# Altium schematic sheet MGMEZZ04TEST.SchDoc
size Letter; Author: Adam Gilbert; CompanyName: McGill University; DrawnBy: Adam Gilbert; Organization: Altium Limited; Address1: McGill Cosmology; Address2: 3600 University Street; Address3: Montreal, Quebec; Address4: Canada; Revision: Rev0; ProjectTitle: Dan DfMux Mezz; ModelNumber: MGMEZZ04; ProjectName: Dan DfMux Mezz
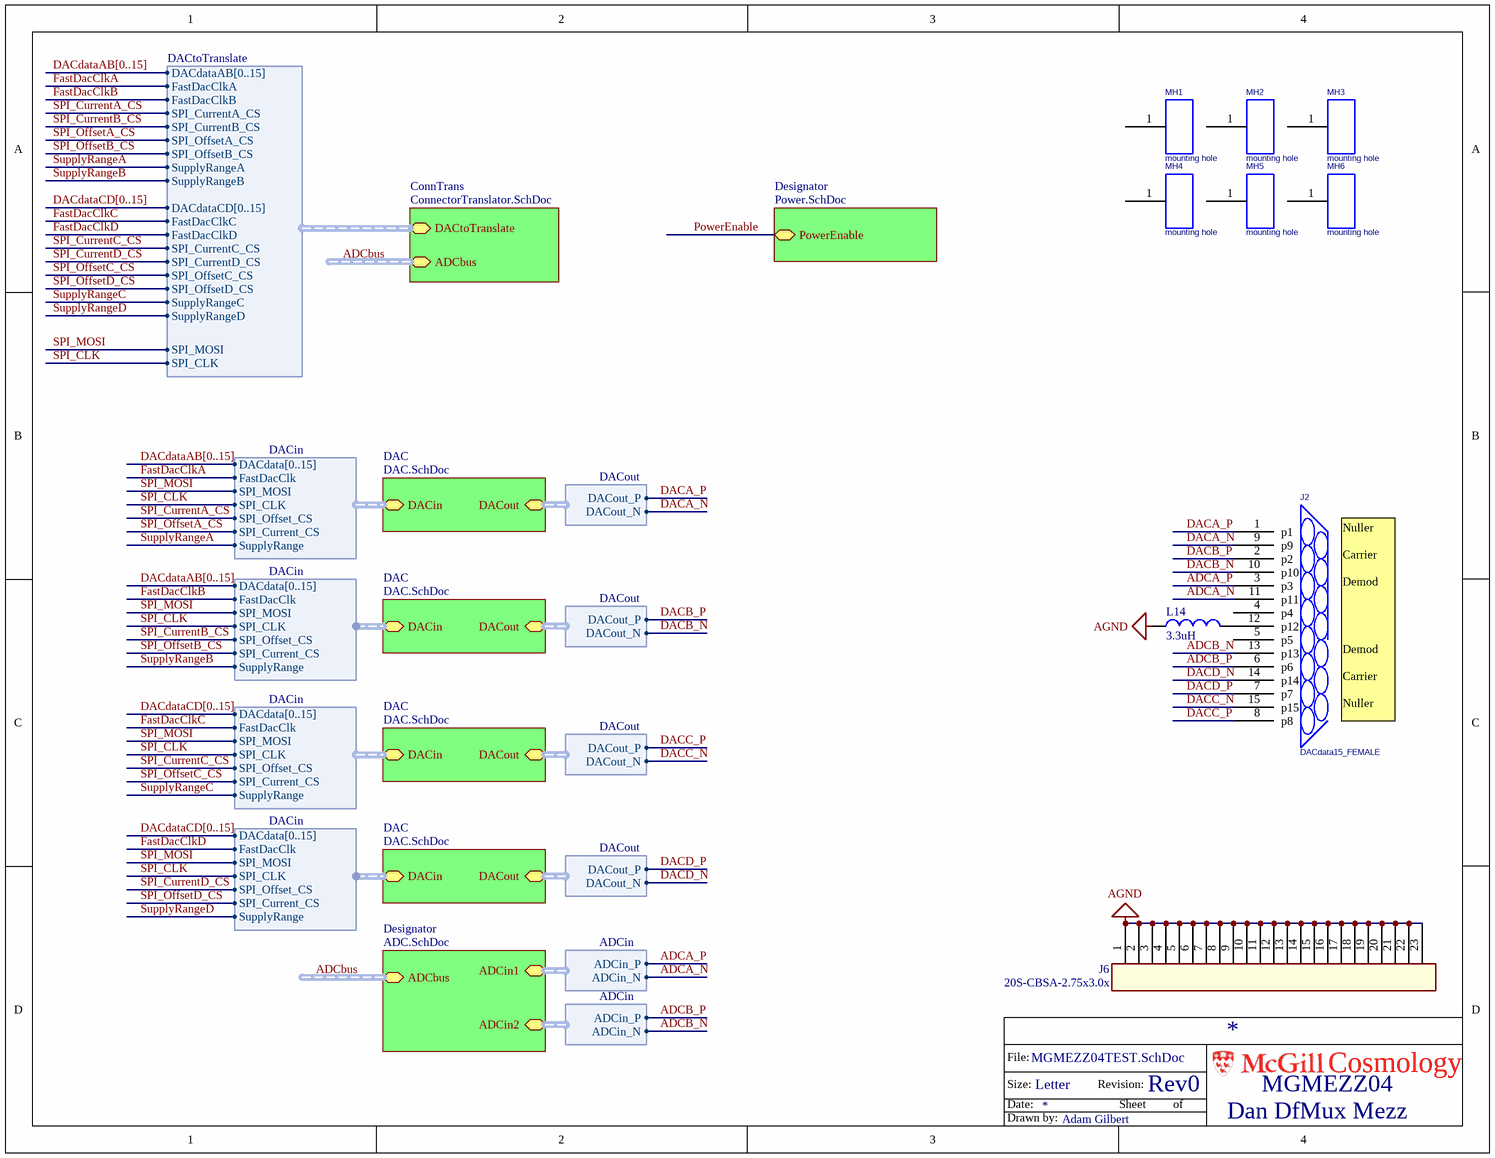
[diagram p0: MGMEZZ04TEST.SchDoc]

## Parts
J2  DACdata15_FEMALE  [DSUB/RS.318/TM/15]
J6  20S-CBSA-2.75x3.0x  [SHIELD 2.75X3.00]
L14  3.3uH  [0805]
MH1  mounting hole  [MTHOLE.125]
MH2  mounting hole  [MTHOLE.125]
MH3  mounting hole  [MTHOLE.125]
MH4  mounting hole  [MTHOLE.125]
MH5  mounting hole  [MTHOLE.125]
MH6  mounting hole  [MTHOLE.125]

## Sub-sheets
ConnTrans = ConnectorTranslator.SchDoc: DACtoTranslate (harness DACtoTranslate), ADCbus (harness ADCbus)
DAC = DAC.SchDoc: DACin (harness DACin), DACout (harness DACout)
DAC = DAC.SchDoc: DACin (harness DACin), DACout (harness DACout)
DAC = DAC.SchDoc: DACin (harness DACin), DACout (harness DACout)
DAC = DAC.SchDoc: DACin (harness DACin), DACout (harness DACout)
Designator = ADC.SchDoc: ADCbus (harness ADCbus), ADCin1 (harness ADCin), ADCin2 (harness ADCin)
Designator = Power.SchDoc: PowerEnable

## Harnesses
ADCin: ADCin_P, ADCin_N
DACout: DACout_P, DACout_N
DACin: DACdata[0..15], FastDacClk, SPI_MOSI, SPI_CLK, SPI_Current_CS, SPI_Offset_CS, SupplyRange
DACtoTranslate: DACdataAB[0..15], FastDacClkA, SPI_MOSI, SPI_CLK, SPI_CurrentA_CS, SPI_OffsetA_CS, SupplyRangeA, FastDacClkB, FastDacClkC, FastDacClkD, SupplyRangeB, SupplyRangeC, SupplyRangeD, SPI_CurrentB_CS, SPI_CurrentC_CS, SPI_CurrentD_CS, DACdataCD[0..15], SPI_OffsetB_CS, SPI_OffsetC_CS, SPI_OffsetD_CS

## Nets
AGND: J6.1 J6.2 J6.3 J6.4 J6.5 J6.6 J6.7 J6.8 J6.9 J6.10 J6.11 J6.12 J6.13 J6.14 J6.15 J6.16 J6.17 J6.18 J6.19 J6.20 J6.21 J6.22 J6.23 L14.1
ADCA_N: J2.11(p11) ; sheet Designator/ADCin1.ADCin_N
ADCA_P: J2.3(p3) ; sheet Designator/ADCin1.ADCin_P
ADCB_N: J2.13(p13) ; sheet Designator/ADCin2.ADCin_N
ADCB_P: J2.6(p6) ; sheet Designator/ADCin2.ADCin_P
DACA_N: J2.9(p9) ; sheet DAC/DACout.DACout_N
DACA_P: J2.1(p1) ; sheet DAC/DACout.DACout_P
DACB_N: J2.10(p10) ; sheet DAC/DACout.DACout_N
DACB_P: J2.2(p2) ; sheet DAC/DACout.DACout_P
DACC_N: J2.15(p15) ; sheet DAC/DACout.DACout_N
DACC_P: J2.8(p8) ; sheet DAC/DACout.DACout_P
DACD_N: J2.14(p14) ; sheet DAC/DACout.DACout_N
DACD_P: J2.7(p7) ; sheet DAC/DACout.DACout_P
FastDacClkA: sheet DAC/DACin.FastDacClk, sheet ConnTrans/DACtoTranslate.FastDacClkA
FastDacClkB: sheet DAC/DACin.FastDacClk, sheet ConnTrans/DACtoTranslate.FastDacClkB
FastDacClkC: sheet DAC/DACin.FastDacClk, sheet ConnTrans/DACtoTranslate.FastDacClkC
FastDacClkD: sheet DAC/DACin.FastDacClk, sheet ConnTrans/DACtoTranslate.FastDacClkD
PowerEnable: sheet Designator/PowerEnable
SPI_CLK: sheet DAC/DACin.SPI_CLK, sheet ConnTrans/DACtoTranslate.SPI_CLK
SPI_CurrentA_CS: sheet DAC/DACin.SPI_Offset_CS, sheet ConnTrans/DACtoTranslate.SPI_CurrentA_CS
SPI_CurrentB_CS: sheet DAC/DACin.SPI_Offset_CS, sheet ConnTrans/DACtoTranslate.SPI_CurrentB_CS
SPI_CurrentC_CS: sheet DAC/DACin.SPI_Offset_CS, sheet ConnTrans/DACtoTranslate.SPI_CurrentC_CS
SPI_CurrentD_CS: sheet DAC/DACin.SPI_Offset_CS, sheet ConnTrans/DACtoTranslate.SPI_CurrentD_CS
SPI_MOSI: sheet DAC/DACin.SPI_MOSI, sheet ConnTrans/DACtoTranslate.SPI_MOSI
SPI_OffsetA_CS: sheet DAC/DACin.SPI_Current_CS, sheet ConnTrans/DACtoTranslate.SPI_OffsetA_CS
SPI_OffsetB_CS: sheet DAC/DACin.SPI_Current_CS, sheet ConnTrans/DACtoTranslate.SPI_OffsetB_CS
SPI_OffsetC_CS: sheet DAC/DACin.SPI_Current_CS, sheet ConnTrans/DACtoTranslate.SPI_OffsetC_CS
SPI_OffsetD_CS: sheet DAC/DACin.SPI_Current_CS, sheet ConnTrans/DACtoTranslate.SPI_OffsetD_CS
SupplyRangeA: sheet DAC/DACin.SupplyRange, sheet ConnTrans/DACtoTranslate.SupplyRangeA
SupplyRangeB: sheet DAC/DACin.SupplyRange, sheet ConnTrans/DACtoTranslate.SupplyRangeB
SupplyRangeC: sheet DAC/DACin.SupplyRange, sheet ConnTrans/DACtoTranslate.SupplyRangeC
SupplyRangeD: sheet DAC/DACin.SupplyRange, sheet ConnTrans/DACtoTranslate.SupplyRangeD
NetJ2_12: J2.12(p12) L14.2

Not connected (* = marked no-connect by the designer): J2 4(p4) 5(p5); MH1 1(A); MH2 1(A); MH3 1(A); MH4 1(A); MH5 1(A); MH6 1(A)

## Buses and harness runs
bus DACdataAB[0..15]
bus DACdataCD[0..15]
harness ADCbus = sheet ConnTrans/ADCbus
harness ADCbus = sheet Designator/ADCbus

## Notes on the sheet
- Nuller
  Carrier
  Demod
  Demod
  Carrier
  Nuller
- File:
- Size:
- Date:
- Letter
- Revision:
- Sheet
- of
- Cosmology
- Drawn by:

## Library data of the parts
J2 = DB15_FEMALE: Part Constraints: 182-015-213R181; Manufacturer: Norcomp; Assembly Comments: none; Manufacturers Part Number: 182-015-213R181; Supplier 1: Digi-Key; Supplier Part Number 1: 182-815FE-ND
J6 = MezzShield
L14 = IND 0805: Inductor 0805; Manufacturer: Coilcraft; Manufacturers Part Number: 0805AF-332; Part Constraints: 3.3uH, 1.2Ohms DRC, 85Mhz SRF, Irms 0.33A; Assembly Comments: none; Type: Inductor; SupplierUnitCost: $0.43; Value: 3.3uH
MH1-MH6 = MTHOLE